# EasyEDA Pro project ProPrj_大功率电调_2026-08-17.epro, board 主控板_1
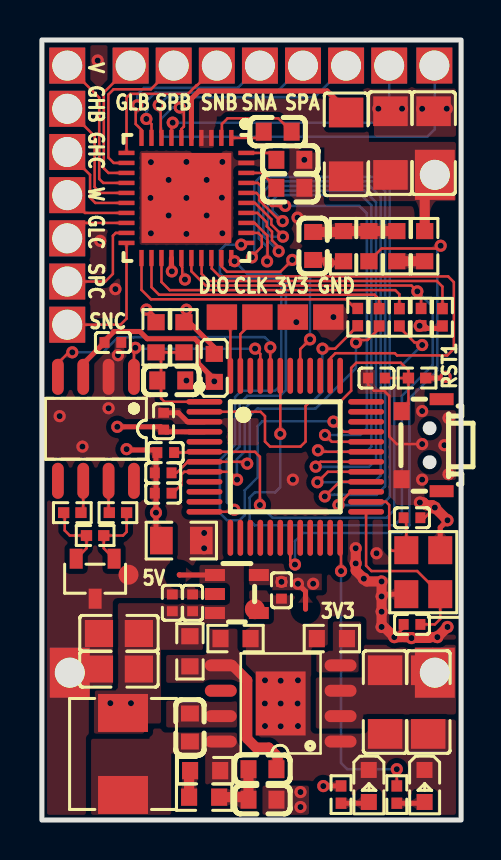
[diagram p23: board, top side]
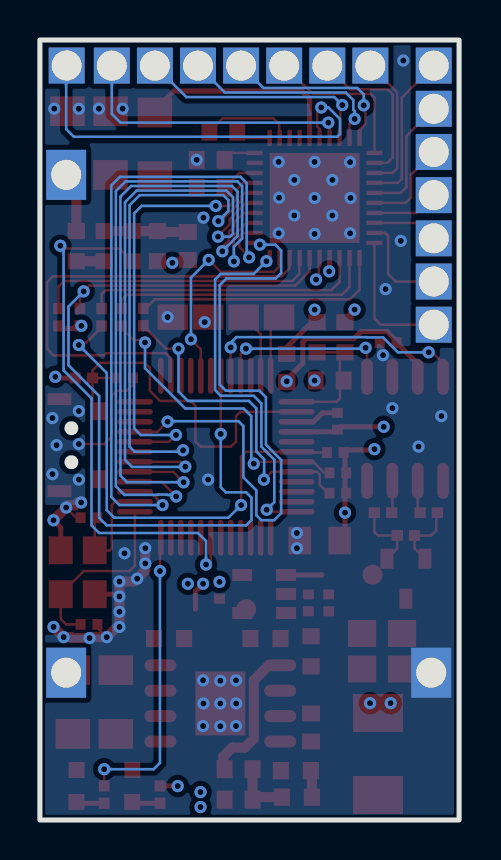
[diagram p24: board, bottom side, seen from below]

Outline 21 x 39 mm; copper layers: Top Layer, Inner1, Inner2, Bottom Layer. Coordinates in mm from the lower left corner of the outline.
Outline path: rectangle 0,39 21,0
Stack: Top Layer 0.035mm Outer layer thickness 1oz / Dielectric1 0.2104mm 7628 RC49% 8.6mil / Inner1 0.0152mm Inner layer thickness / Dielectric2 1.065mm 1.1mm H/HOZ Copper / Inner2 0.0152mm Inner layer thickness / Dielectric3 0.2104mm 7628 RC49% 8.6mil / Bottom Layer 0.035mm Outer layer thickness 1oz

## Design rules (mm)
spacing copperThickness1oz (default): track to track 0.102, other pairs 0.152 to 0.3
spacing copperThickness2oz: track to track 0.203, other pairs 0.152 to 0.3
track width copperThickness1oz (default): min 0.127, default 0.127, max 2.54
track width copperThickness2oz: min 0.203, default 0.254, max 2.54
differential pair differentialPair (default): width min 0.127, default 0.254, max 2.54; gap min 0.152, default 0.152
net VCC_BUS uses copperRegion
net GND uses copperRegion
net $3N8 uses copperRegion
net $3N9 uses copperRegion
net 5V uses copperRegion
net FB uses copperRegion
net 3V3 uses copperRegion
net 3V3_A uses copperRegion
net $1N26 uses copperRegion
net $3N14 uses copperRegion
net VBUS_ADC uses copperRegion

## Placement (name value [footprint] x y rotation side)
C1  47nf  [C0603]  11.81 34.42 180 top
C2  10uF/100v  [C1206]  19.62 33.85 270 top
C3  100nF/100v  [C1206]  17.46 33.85 270 top
C4  1uF  [C1206]  15.24 33.78 90 top
C5  1uf  [C0603]  12.45 33.01 0 top
C6  1uf  [C0603]  12.45 31.61 0 top
C7  1nF  [C0402]  6.08 16.34 0 top
C8  1nF  [C0402]  6.08 17.36 0 top
C9  1nF  [C0402]  6.2 18.37 0 top
C10  2.2nF/50v  [C0603]  7.42 4.63 270 top
C11  22µF/16V  [C0805]  3.86 9.33 0 top
C12  22µF/16V  [C0805]  3.86 7.55 0 top
C13  2.2uf/100v  [C1206]  17.19 5.9 90 top
C14  100nF/100v  [C1206]  19.35 5.9 90 top
C15  3.3nf/50v  [C0603]  11.05 1.02 180 top
C16  150pf/50v  [C0603]  11.05 2.54 180 top
C17  1uF  [C0402]  6.53 10.86 270 top
C18  100nF  [C0402]  7.55 10.86 270 top
C19  1uF  [C0402]  12 11.49 90 top
C20  20pf  [C0402]  18.54 9.78 180 top
C21  100nF  [C0402]  6.1 19.94 270 top
C28  20pf  [C0402]  18.54 15.11 0 top
C29  100nF  [C0402]  16.76 22.1 0 top
C30  100nF  [C0402]  3.56 23.88 0 top
C32  10nF  [C0603]  13.59 28.7 90 top
C33  100nF  [C0603]  6.48 21.98 180 top
D1  PESD2CAN,215  [SOT-23-3_L2.9-W1.3-P1.90-LS2.4-BR]  2.67 12.06 90 top
L1  33uH  [IND-SMD_L5.4-W5.2]  4.06 3.3 270 top
L2  BLM18PG121SN1D  [L0603]  8.64 22.61 90 top
LED1  -  [LED_0603]  16.38 1.65 270 top
LED2  -  [LED_0603]  19.18 1.65 270 top
MARK2  -  [Mark-Point-1mm]  6.88 12.27 0 top
NOREF  -  [Pad_e258]  1.27 35.56 180 top
NOREF#2  -  [Pad_e255]  1.27 29.08 180 top
NOREF#3  -  [Pad_e259]  1.27 37.72 180 top
NOREF#4  -  [Pad_e975]  12.57 25.15 0 top
NOREF#5  -  [Pad_e261]  8.76 37.72 270 top
NOREF#6  -  [Pad_e262]  4.44 37.72 270 top
NOREF#7  -  [Pad_e254]  1.27 26.92 180 top
NOREF#8  -  [Pad_e266]  17.4 37.72 270 top
NOREF#9  -  [Pad_e944]  10.79 25.15 0 top
NOREF#10  -  [Pad_e981]  14.35 25.15 0 top
NOREF#11  -  [Pad_e250]  19.69 7.37 180 top
NOREF#12  -  [Pad_e257]  1.27 33.4 180 top
NOREF#13  -  [Pad_e263]  10.92 37.72 270 top
NOREF#14  -  [Pad_e253]  1.27 24.77 180 top
NOREF#15  -  [Mark-Point-1mm]  13.21 10.54 0 top
NOREF#16  -  [Pad_e264]  13.08 37.72 270 top
NOREF#17  -  [Pad_e921]  9.02 25.15 0 top
NOREF#18  -  [Pad_e260]  6.6 37.72 270 top
NOREF#19  -  [Pad_e267]  19.66 37.72 270 top
NOREF#20  -  [Pad_e706]  19.69 32.26 180 top
NOREF#21  -  [Pad_e256]  1.27 31.24 180 top
NOREF#22  -  [Pad_e247]  1.4 7.37 0 top
NOREF#23  -  [Pad_e265]  15.24 37.72 270 top
R1  10K  [R0402]  18.8 22.1 180 top
R2  5.1  [R0402]  3.81 15.37 0 top
R3  5.1  [R0402]  1.52 15.37 180 top
R4  120  [R0402]  2.67 14.22 0 top
R5  0  [R0805]  6.99 13.97 0 top
R6  10K  [R0402]  14.99 1.27 270 top
R7  10K  [R0402]  17.78 1.27 270 top
R28  10K  [R0402]  20.07 25.14 90 top
R29  10K  [R0402]  19 25.14 90 top
R30  100  [R0402]  17.91 25.14 90 top
R31  100  [R0402]  16.89 25.14 90 top
R32  100  [R0402]  15.82 25.14 90 top
R33  68K  [R0603]  8.18 2.47 180 top
R34  158k  [R0603]  7.42 8.44 90 top
R35  68K  [R0603]  8.13 1.14 180 top
R36  49.9k  [R0603]  9.7 9.07 180 top
R37  31.6k  [R0603]  14.53 9.07 0 top
R43  100  [R0603]  16.38 28.69 270 top
R47  330K  [R0603]  19.18 28.69 270 top
R48  330K  [R0603]  17.78 28.69 90 top
R49  36K  [R0603]  15.11 28.69 270 top
R51  10k  [R0603]  7.12 24.14 270 top
R52  HNTC0603-103F3950FB  [R0603]  5.72 24.14 90 top
RST1  侧按侧贴开关  [KEY-SMD_1TS003B]  19.02 18.74 90 top
U1  DRV8353SRTAR  [WQFN-40_L6.0-W6.0-P0.50-TL-EP4.5]  7.24 31.1 270 top
U2  LKS32MC071CBT8  [TQFP-48_L7.0-W7.0-P0.50-LS9.0-BL]  12.19 18.16 270 top
U3  LM5164DDAR  [SO-8_L4.9-W3.9-P1.27-LS6.0-BL-EP]  11.96 5.83 90 top
U4  SPX3819-3.3  [SOT-23-5_L2.9-W1.6-P0.95-LS2.8-BL]  9.77 11.3 270 top
U7  TCAN332DR  [SOIC-8_L4.9-W3.9-P1.27-LS6.0-BL]  2.71 19.56 180 top
X1  8MHz  [CRYSTAL-SMD_4P-L3.2-W2.5-BL]  19.11 12.39 90 top

## Footprints (pads in the part's own frame, mm; a bottom-side part is the same pattern mirrored in y, then rotated)
C0402
  rect 0.5x0.54 smd: 1(-0.42,0) 2(0.42,0)
C0603
  rect 0.8x0.9 smd: 1(-0.7,0) 2(0.7,0)
C0805
  rect 1.41x1.35 smd: 1(-1,0) 2(1,0)
C1206
  rect 1.485x1.728 smd: 1(-1.593,0) 2(1.593,0)
CRYSTAL-SMD_4P-L3.2-W2.5-BL
  rect 1.4x1.2 smd: 1(-1.1,-0.85) 2(1.1,-0.85) 3(1.1,0.85) 4(-1.1,0.85)
IND-SMD_L5.4-W5.2
  rect 1.9x2.5 smd: 1(2.05,0) 2(-2.05,0)
KEY-SMD_1TS003B
  rect 0.9x0.8 smd: 1(1.7,1) 2(-1.7,1)
  rect 0.6x1.2 smd: 3(-2.3,-1) 4(2.3,-1)
L0603
  rect 0.8x0.864 smd: 1(-0.7,0) 2(0.7,0)
LED_0603
  rect 0.8x0.8 smd: 1(-0.851,-0.01) 2(0.75,-0.005)
Mark-Point-1mm
  round 1 smd: 1(-2.54,0)
Pad_e247
  rect 2x2.5 hole 1.5: 1(0,0)
Pad_e250
  rect 2x2.5 hole 1.5: 1(0,0)
Pad_e253
  rect 1.8x1.8 hole 1.5: 1(0,0)
Pad_e254
  rect 1.8x1.8 hole 1.5: 1(0,0)
Pad_e255
  rect 1.8x1.8 hole 1.5: 1(0,0)
Pad_e256
  rect 1.8x1.8 hole 1.5: 1(0,0)
Pad_e257
  rect 1.8x1.8 hole 1.5: 1(0,0)
Pad_e258
  rect 1.8x1.8 hole 1.5: 1(0,0)
Pad_e259
  rect 1.8x1.8 hole 1.5: 1(0,0)
Pad_e260
  rect 1.8x1.8 hole 1.5: 1(0,0)
Pad_e261
  rect 1.8x1.8 hole 1.5: 1(0,0)
Pad_e262
  rect 1.8x1.8 hole 1.5: 1(0,0)
Pad_e263
  rect 1.8x1.8 hole 1.5: 1(0,0)
Pad_e264
  rect 1.8x1.8 hole 1.5: 1(0,0)
Pad_e265
  rect 1.8x1.8 hole 1.5: 1(0,0)
Pad_e266
  rect 1.8x1.8 hole 1.5: 1(0,0)
Pad_e267
  rect 1.8x1.8 hole 1.5: 1(0,0)
Pad_e706
  rect 2x2.5 hole 1.5: 1(0,0)
Pad_e921
  rect 1.524x1.27 smd: 1(0,0)
Pad_e944
  rect 1.524x1.27 smd: 1(0,0)
Pad_e975
  rect 1.524x1.27 smd: 1(0,0)
Pad_e981
  rect 1.524x1.27 smd: 1(0,0)
R0402
  rect 0.566x0.54 smd: 1(-0.433,0) 2(0.433,0)
R0603
  rect 0.806x0.864 smd: 1(-0.753,0) 2(0.753,0)
R0805
  rect 1.133x1.377 smd: 1(-1,0) 2(1,0)
SO-8_L4.9-W3.9-P1.27-LS6.0-BL-EP
  oval 0.6x1.6 smd: 1(-1.905,-3) 2(-0.635,-3) 3(0.635,-3) 4(1.905,-3) 5(1.905,3) 6(0.635,3) 7(-0.635,3) 8(-1.905,3)
  rect 3.2x2.5 smd: 9(0,0)
SOIC-8_L4.9-W3.9-P1.27-LS6.0-BL
  oval 0.588x1.8 smd: 1(-1.905,-2.6) 2(-0.635,-2.6) 3(0.635,-2.6) 4(1.905,-2.6) 5(1.905,2.6) 6(0.635,2.6) 7(-0.635,2.6) 8(-1.905,2.6)
SOT-23-3_L2.9-W1.3-P1.90-LS2.4-BR
  rect 1x0.65 smd: 1(1,-0.95) 2(1,0.95) 3(-1,0)
SOT-23-5_L2.9-W1.6-P0.95-LS2.8-BL
  rect 0.6x1 smd: 1(-0.95,-1.1) 2(0,-1.1) 3(0.95,-1.1) 4(0.95,1.1) 5(-0.95,1.1)
TQFP-48_L7.0-W7.0-P0.50-LS9.0-BL
  oval 0.28x1.8 smd: 1(-2.75,-4.05) 2(-2.25,-4.05) 3(-1.75,-4.05) 4(-1.25,-4.05) 5(-0.75,-4.05) 6(-0.25,-4.05) 7(0.25,-4.05) 8(0.75,-4.05) 9(1.25,-4.05) 10(1.75,-4.05) 11(2.25,-4.05) 12(2.75,-4.05) 25(2.75,4.05) 26(2.25,4.05) 27(1.75,4.05) 28(1.25,4.05) 29(0.75,4.05) 30(0.25,4.05) 31(-0.25,4.05) 32(-0.75,4.05) 33(-1.25,4.05) 34(-1.75,4.05) 35(-2.25,4.05) 36(-2.75,4.05)
  oval 1.8x0.28 smd: 13(4.05,-2.75) 14(4.05,-2.25) 15(4.05,-1.75) 16(4.05,-1.25) 17(4.05,-0.75) 18(4.05,-0.25) 19(4.05,0.25) 20(4.05,0.75) 21(4.05,1.25) 22(4.05,1.75) 23(4.05,2.25) 24(4.05,2.75) 37(-4.05,2.75) 38(-4.05,2.25) 39(-4.05,1.75) 40(-4.05,1.25) 41(-4.05,0.75) 42(-4.05,0.25) 43(-4.05,-0.25) 44(-4.05,-0.75) 45(-4.05,-1.25) 46(-4.05,-1.75) 47(-4.05,-2.25) 48(-4.05,-2.75)
WQFN-40_L6.0-W6.0-P0.50-TL-EP4.5
  rect 0.8x0.22 smd: 1(-3,2.25) 2(-3,1.75) 3(-3,1.25) 4(-3,0.75) 5(-3,0.25) 6(-3,-0.25) 7(-3,-0.75) 8(-3,-1.25) 9(-3,-1.75) 10(-3,-2.25) 21(3,-2.25) 22(3,-1.75) 23(3,-1.25) 24(3,-0.75) 25(3,-0.25) 26(3,0.25) 27(3,0.75) 28(3,1.25) 29(3,1.75) 30(3,2.25)
  rect 0.22x0.8 smd: 11(-2.25,-3) 12(-1.75,-3) 13(-1.25,-3) 14(-0.75,-3) 15(-0.25,-3) 16(0.25,-3) 17(0.75,-3) 18(1.25,-3) 19(1.75,-3) 20(2.25,-3) 31(2.25,3) 32(1.75,3) 33(1.25,3) 34(0.75,3) 35(0.25,3) 36(-0.25,3) 37(-0.75,3) 38(-1.25,3) 39(-1.75,3) 40(-2.25,3)
  rect 4.5x4.5 smd: 41(0,0)

## Nets
3V3: C19.2 C30.1 L2.1 NOREF#4.1 NOREF#15.1 R1.1 R6.1 R28.1 R29.1 U4.5 U7.3
3V3_A: C21.2 L2.2 R51.1 U1.24 U2.4
5V: C11.2 C12.2 C15.1 C17.2 C18.2 L1.2 MARK2.1 R34.2 U4.1 U4.3
AGND: C7.1 C8.1 C9.1 C32.1 C33.1 R5.1 R49.2 R52.2 U1.25
GND: C2.1 C3.1 C5.2 C6.2 C11.1 C12.1 C13.1 C14.1 C17.1 C18.1 C19.1 C20.2 C21.1 C28.2 C29.1 C30.2 D1.3 LED1.1 LED2.1 NOREF#10.1 NOREF#22.1 R5.2 R36.1 R37.1 RST1.2 U1.39 U1.41 U2.3 U3.1 U3.9 U4.2 U7.2 X1.2 X1.4
PVCC_BUS: C2.2 C3.2 C4.1 NOREF#20.1 R47.1 U1.3 U1.4
VBUS_ADC: R43.2 U2.19
VCC_BUS: C13.2 C14.2 NOREF#11.1 U3.2 U3.3
CANH: D1.1 R2.2 R4.2
CANL: D1.2 R3.2 R4.1
ENABLE: U1.31 U2.33
FB: C16.1 R34.1 R36.2 U3.5
GHA: NOREF#19.1 U1.6
GHB: NOREF.1 U1.15
GHC: NOREF#12.1 U1.16
GLA: NOREF#23.1 U1.8
GLB: NOREF#6.1 U1.13
GLC: NOREF#2.1 U1.18
INHA: U1.32 U2.27
INHB: U1.34 U2.29
INHC: U1.36 U2.31
INLA: U1.33 U2.28
INLB: U1.35 U2.30
INLC: U1.37 U2.32
LED: R7.1 U2.24
nFAULT: R29.2 U1.26 U2.43
NRST: C29.2 R1.2 RST1.1 U2.2
nSCS: U1.30 U2.12
NTC_ADC: C33.2 R51.2 R52.1 U2.1
OSC_IN: C20.1 U2.25 X1.1
OSC_OUT: C28.1 U2.26 X1.3
RAMP_NODE: C15.2 C16.2 R35.1
RXD: U2.44 U7.4
SCLK: U1.29 U2.41
SD0: U2.37
SDI: U1.28 U2.38
SDO: R28.2 U1.27
SNA: NOREF#13.1 U1.10
SNB: NOREF#5.1 U1.11
SNC: NOREF#14.1 U1.20
SOA: C9.2 R30.1 U2.6
SOB: C8.2 R31.1 U2.7
SOC: C7.2 R32.1 U2.8
SPA: NOREF#16.1 U1.9
SPB: NOREF#18.1 U1.12
SPC: NOREF#7.1 U1.19
SWCLK: NOREF#9.1 U2.47
SWDIO: NOREF#17.1 U2.48
TXD: U2.45 U7.1
U: NOREF#8.1 U1.7
V: NOREF#3.1 U1.14
W: NOREF#21.1 U1.17
$1N4: LED2.2 R7.2
$1N5: LED1.2 R6.2
$1N19: R2.1 U7.7
$1N20: R3.1 U7.6
$1N26: C32.2 R43.1 R48.2 R49.1
$1N27: R47.2 R48.1
$2N6: C6.1 U1.38
$2N8: C5.1 U1.40
$2N26: R32.2 U1.21
$2N27: R31.2 U1.22
$2N28: R30.2 U1.23
$2N30: C4.2 U1.5
$2N42: C1.1 U1.2
$2N43: C1.2 U1.1
$3N3: R33.2 R35.2
$3N8: C10.2 L1.1 R33.1 U3.8
$3N9: C10.1 U3.7
$3N14: R37.2 U3.4

Pads without a net: RST1 3 4; U2 5 9 10 11 13 14 15 16 17 18 20 21 22 23 34 35 36 39 40 42 46; U3 6; U4 4; U7 5 8

## Via types
v1: diameter 0.61, hole 0.305, Top Layer to Bottom Layer, 120 vias

## Routing (per net, layer and track width the routed paths; a pad name or vN(x,y) marks a point on that pad's centre or on a via; arc(x,y) is an arc through that point)
3V3: length 58
  Top Layer w0.127: 19.3,24.58 19.06,24.58 v1(18.92,24.71)
  Top Layer w0.254: R6.1 14.1,1.7 v1(14.1,1.7) ; 20.07,24.58 19.3,24.58 19.17,24.71 v1(18.92,24.71) ; v1(12.83,11.81) 13.21,11.43 13.21,10.54 ; v1(20.23,22.16) 20.17,22.1 R1.1 ; 8.64,22.03 7.83,22.84 7.83,23.9 7.66,24.06 5.27,24.06 4.91,24.42 3.61,24.42 3.14,23.95 C30.1 2.07,22.81 2.07,22.16
  Inner2 w0.254: 17.4,22.16 17.4,24.13 17.98,24.71 v1(18.92,24.71) ; 17.4,22.16 v1(20.23,22.16) ; 17.4,22.16 12.78,22.16 ; v1(14.1,1.7) 13.59,2.2 v1(13.59,11.81) v1(12.83,11.81) 9.4,11.81 9.06,12.15 9.06,19.22 9.78,19.94 9.78,22.16 8.86,22.16 v1(8.64,21.93) ; 12.78,22.16 12.78,24.85 v1(12.74,24.89) ; 12.78,22.16 9.78,22.16
  vias: v1(12,11.91)
3V3_A: length 21.8
  Top Layer w0.127: v1(7.24,25.51) 7.37,25.38 7.37,24.89
  Top Layer w0.254: 8.64,23.43 8.64,23.63 7.37,24.89 7.12,24.89 R51.1 ; U2.4 6.2,19.41 5.96,19.66 v1(3.78,19.66) ; v1(6.51,27.43) 6.49,27.45 U1.24
  Inner2 w0.254: v1(3.78,19.66) 4.06,19.95 4.06,21.46 3.05,22.48 3.05,27.05 3.43,27.43 v1(6.51,27.43) 6.51,26.26 7.24,25.53
5V: length 1.8
  Top Layer w0.254: 6.88,12.27 6.9,12.25 8.67,12.25
  vias: v1(3.43,5.84) v1(4.46,5.84) v1(12.95,1.4) v1(12.95,0.65)
AGND: length 9.8
  Top Layer w0.127: v1(7.17,27.02) 7.03,27.16 7.03,27.65 6.99,27.69 U1.25 ; 5.97,24.89 5.34,25.52 v1(5.24,25.52)
  Top Layer w0.254: C32.1 14.22,28 v1(14.37,27.86) 15.03,27.86 R49.2 ; R5.1 5.72,14.24 v1(5.72,15.37) 5.72,18.37 ; 4.23,18.5 5.6,18.5 5.73,18.37
  vias: v1(4.24,18.54) v1(7.24,21.97)
GND: length 22.7
  Top Layer w0.127: v1(19.69,15.62) 19.18,15.11 C28.2 ; v1(19.05,18.8) 17.78,18.8 17.4,19.18 17.4,21.21 17.15,21.46 16.64,21.46 16.34,21.76 C29.1 ; C20.2 18.12,9.61 v1(17.65,9.14)
  Top Layer w0.254: C21.1 6.84,20.36 7.29,19.91 U2.3 ; X1.4 17.13,11.29 v1(17.02,11.18) ; v1(20.32,14.99) 19.96,14.62 X1.2
  Top Layer w0.508: v1(18.94,15.88) 19.12,15.88 19.26,15.73 19.57,15.73 v1(19.69,15.62) v1(20.32,14.99) ; v1(20.32,9.65) v1(19.81,9.14) 19.42,9.14 19.38,9.1 18.54,9.1 18.5,9.14 v1(17.65,9.14) 17.02,9.78 v1(17.02,10.41) v1(17.02,11.18) v1(17.02,11.93) 16.27,11.93 v1(16.13,12.06) 15.72,12.47 v1(15.72,12.83) v1(15.72,13.59)
  vias: v1(0.89,20.19) v1(2.03,18.67) v1(2.79,37.97) v1(2.92,28.96) v1(3.34,20.59) v1(3.68,26.54) v1(3.81,23.24) v1(5.44,31.1) v1(5.46,32.89) v1(5.46,29.34) v1(6.35,32) v1(6.35,30.23) v1(7.24,32.9) v1(7.24,31.1) v1(7.24,29.3) v1(8.13,14.35) v1(8.13,13.59) v1(8.25,32) v1(8.25,30.23) v1(9.04,32.9) v1(9.02,31.11) v1(9.04,29.34) v1(11.18,6.98) v1(11.17,5.83) v1(11.18,4.7) v1(11.96,6.96) v1(11.96,5.83) v1(11.96,4.69) v1(12.57,17.02) v1(12.81,30.12) v1(12.83,6.98) v1(12.81,5.83) v1(12.83,4.7) v1(13.15,33.01) v1(14.6,25.15) v1(16.76,13.33) v1(16.86,35.56) v1(17.02,9.65) v1(18.04,35.56) v1(18.52,9.1) v1(19.05,35.56) v1(19.05,20.45) v1(19.05,17.02) v1(20.16,18.74) v1(20.28,35.56) v1(20.37,20.1) v1(20.37,17.29)
PVCC_BUS: length 3.1
  Top Layer w0.508: 19.18,29.44 19.18,31.94 19.62,32.38
VBUS_ADC: length 27.2
  Top Layer w0.127: v1(19.98,28.71) 19.84,28.58 17.02,28.58 R43.2 ; U2.19 12.44,12.96 12.63,12.77 v1(12.68,12.77)
  Bottom Layer w0.127: v1(19.98,28.71) 19.81,28.55 19.81,22.48 18.41,21.08 18.41,14.73 18.03,14.35 13.08,14.35 12.68,13.95 v1(12.68,12.77)
CANH: length 3.6
  Top Layer w0.127: R2.2 4.24,14.4 4.06,14.22 R4.2 3.1,13.58 D1.1
CANL: length 3.5
  Top Layer w0.127: D1.2 2.23,13.58 R4.1 1.4,14.22 1.14,14.48 1.14,15.31 R3.2
ENABLE: length 31.3
  Top Layer w0.127: v1(14.6,19.92) 15.11,19.41 U2.33
  Bottom Layer w0.127: v1(9.98,28.77) 9.21,28.77 8.91,28.47 8.91,27.35 9.19,27.08 11.66,27.08 12,26.74 12,21.77 11.68,21.46 10,21.46 9.68,21.14 9.68,18.76 8.91,18 8.91,15.34 9.27,14.99 9.91,14.99 10.16,15.24 10.16,16.48 10.81,17.13 10.81,19.7 11.05,19.94 14.59,19.94 v1(14.6,19.92)
FB: length 7.1
  Top Layer w0.508: U3.5 9.54,7.73 10.29,6.98 10.29,4.06 10.73,3.62 11.37,3.62 11.81,3.17 11.81,2.6 C16.1
GHA: length 20.7
  Top Layer w0.127: v1(6.91,35.62) 7.11,35.42 7.11,34.67 6.99,34.55 U1.6
  Bottom Layer w0.127: v1(6.91,35.62) 6.54,35.62 5.97,35.05 5.97,34.29 6.1,34.16 19.3,34.16 19.69,34.54 19.69,37.7 NOREF#19.1
GHB: length 6.2
  Top Layer w0.127: U1.15 2.94,31.35 2.64,31.65 2.64,34.19 NOREF.1
GHC: length 4.7
  Top Layer w0.127: NOREF#12.1 2.41,32.26 2.41,31.11 2.67,30.85 U1.16
GLA: length 11.9
  Top Layer w0.127: U1.8 6.01,34.13 6.01,34.33 5.95,34.39 5.95,35.65 v1(5.85,35.75)
  Bottom Layer w0.127: NOREF#23.1 13.67,36.15 6.25,36.15 v1(5.85,35.75)
GLB: length 6.9
  Top Layer w0.127: U1.13 3.33,32.35 3.1,32.59 3.1,36.37 NOREF#6.1
GLC: length 3.3
  Top Layer w0.127: NOREF#2.1 2.04,29.85 U1.18
INHA: length 32.9
  Top Layer w0.127: v1(14.86,15.75) 15.13,16.02 15.13,16.06 15.48,16.41 U2.27 ; v1(10.52,28.13) 10.52,28.17 11.01,28.67 11.01,29.17 10.84,29.35 U1.32
  Bottom Layer w0.127: v1(14.86,15.75) 17.02,15.75 17.42,16.15 17.42,31.72 16.99,32.16 10.95,32.16 10.64,31.85 10.64,28.34 10.52,28.22 v1(10.52,28.13)
INHB: length 32.3
  Top Layer w0.127: U2.29 14.33,17.41 v1(13.8,16.89) ; U1.34 10.79,30.35 11.27,29.88 11.27,29.68 11.53,29.42 11.53,28.98 11.86,28.65 v1(11.86,28.44)
  Bottom Layer w0.127: v1(13.8,16.89) 13.81,16.89 16.64,16.89 16.97,17.22 16.97,31.17 16.43,31.7 11.38,31.7 11.1,31.42 11.1,29.2 v1(11.86,28.44)
INHC: length 26.4
  Top Layer w0.127: v1(12.06,29.94) 11.94,29.94 10.9,30.98 10.9,31.19 10.74,31.35 U1.36 ; U2.31 13.9,18.41 v1(13.83,18.48)
  Bottom Layer w0.127: v1(13.83,18.48) 13.9,18.42 16.26,18.42 16.51,18.67 16.51,30.74 16,31.24 11.81,31.24 11.56,30.99 11.56,30.45 v1(12.06,29.94)
INLA: length 33.6
  Top Layer w0.127: U1.33 10.66,29.85 11.3,29.22 11.3,28.89 11.3,28.88 11.3,27.95 v1(11.28,27.93) ; v1(14.17,16.18) 14.91,16.91 U2.28
  Bottom Layer w0.127: v1(11.28,27.93) 11.28,28.66 10.87,29.07 10.87,31.7 11.1,31.93 16.71,31.93 17.19,31.45 17.19,16.69 16.76,16.26 15.09,16.26 15.07,16.27 14.64,16.27 14.63,16.26 14.25,16.26 v1(14.17,16.18)
INLB: length 29.8
  Top Layer w0.127: v1(13.72,17.67) 13.96,17.91 U2.30 ; U1.35 10.68,30.85 11.5,30.03 11.5,29.78 12.08,29.19 v1(12.08,29.17)
  Bottom Layer w0.127: v1(13.72,17.67) 13.73,17.65 16.38,17.65 16.74,18.01 16.74,30.89 16.15,31.47 11.66,31.47 11.33,31.14 11.33,29.31 11.47,29.17 v1(12.08,29.17)
INLC: length 22.1
  Top Layer w0.127: U2.32 14.52,18.91 v1(14.18,19.25) ; v1(12.19,30.7) 11.5,30.7 11.13,31.07 11.13,31.54 10.82,31.85 U1.37
  Bottom Layer w0.127: v1(14.18,19.25) 15.95,19.25 16.28,19.58 16.28,30.33 15.9,30.7 v1(12.19,30.7)
LED: length 15
  Top Layer w0.127: U2.24 14.99,14.07 v1(14.99,12.45) ; v1(17.78,2.54) R7.1
  Bottom Layer w0.127: v1(17.78,2.54) 15.3,2.54 14.99,2.85 v1(14.99,12.45)
NFAULT: length 31.2
  Top Layer w0.127: 19,25.45 19,26.24 18.81,26.43 ; 18.52,26.72 8.2,26.72
  Bottom Layer w0.127: 10.67,14.73 17.65,14.73 18.03,15.11 18.03,21.2 19.57,22.74 19.57,25.67 18.81,26.43
nFAULT: length 10.9
  Top Layer w0.127: U2.43 v1(11.94,19.3) ; 8.2,26.72 7.49,27.44 U1.26 ; 18.52,26.72 v1(18.81,26.43)
  Bottom Layer w0.127: 10.67,14.73 10.4,15 10.4,16.12 10.67,16.38 11.68,16.38 11.94,16.64 v1(11.94,19.3)
NRST: length 18.4
  Top Layer w0.127: R1.2 18.36,20.78 RST1.1 ; R1.2 18.36,22.48 17.98,22.86 15.75,22.86 15.49,22.61 15.49,21.46 14.99,20.95 13.46,20.95 13.21,20.7 13.21,18.92 12.95,18.67 11.43,18.67 11.18,18.92 11.18,20.19 10.96,20.41 U2.2 ; R1.2 17.44,22.1
NSCS: length 16.8
  Bottom Layer w0.127: v1(9.65,27.94) 10.29,27.31 11.94,27.31 12.22,27.02 12.22,21.5 11.94,21.21 10.29,21.21 9.91,20.83 9.91,18.67 9.26,18.02 9.26,15.89 9.64,15.51
nSCS: length 1.5
  Top Layer w0.127: v1(9.64,15.51) 9.54,15.41 U2.12
NTC_ADC: length 5.9
  Top Layer w0.127: 5.85,23.38 5.97,23.38 ; 5.97,23.38 7.24,23.38 ; 5.97,23.38 5.97,23.38 5.97,21.08 6.14,20.91 U2.1
OSC_IN: length 9.3
  Top Layer w0.127: U2.25 16.24,12.71 16.51,12.45 18.8,12.45 X1.1 19.96,10.05 19.69,9.78 C20.1
OSC_OUT: length 6
  Top Layer w0.127: U2.26 17.24,15.91 17.4,15.75 17.4,13.59 17.53,13.46 18.23,13.46 X1.3 18.26,14.98 C28.1
RAMP_NODE: length 3
  Top Layer w0.508: R35.1 10.22,1.14 10.35,1.02 10.35,2.54
RXD: length 13.6
  Top Layer w0.127: 0.8,22.16 0.8,22.84 1.34,23.38 v1(1.52,23.38) ; U2.44 v1(11.44,23.63)
  Bottom Layer w0.127: v1(1.52,23.38) 3.06,23.38 3.81,24.13 4.6,24.13 4.61,24.14 11.16,24.14 11.44,23.86 v1(11.44,23.63)
SCLK: length 10.7
  Top Layer w0.127: v1(13.43,24.03) 12.94,23.54 U2.41 ; U1.29 8.99,27.69 9.27,27.41 11.95,27.41 v1(12.54,28)
  Bottom Layer w0.127: v1(12.54,28) 13.43,27.11 v1(13.43,24.03)
SDI: length 23.6
  Top Layer w0.127: U2.38 14.48,22.25 14.48,23.11 14.7,23.34 17.68,23.34 17.79,23.23 20.31,23.23 20.64,23.56 20.64,26.89 20.35,27.18 8.9,27.18 8.51,27.57 8.51,28.08 U1.28
SDO: length 14.4
  Top Layer w0.127: 20.07,25.44 20.07,26.67 19.78,26.95 8.35,26.95 8,27.31 8,28.09 U1.27
SNA: length 9.1
  Top Layer w0.127: U1.10 4.99,34.51 4.7,34.8 4.7,35.65 v1(4.78,35.73)
  Bottom Layer w0.127: NOREF#13.1 9.81,36.6 5.11,36.6 4.78,36.27 v1(4.78,35.73)
SNB: length 7.9
  Top Layer w0.127: U1.11 4.24,36.12 4.43,36.31 7.32,36.31 7.75,36.74 7.79,36.74 NOREF#5.1
SNC: length 6.9
  Top Layer w0.127: U1.20 4.24,25.07 3.94,24.77 NOREF#14.1
SOA: length 24.2
  Top Layer w0.127: 17.91,24.58 17.97,24.58 18.67,23.88 18.92,23.88 v1(19.05,23.75) ; 6.75,18.37 8.1,18.37 U2.6 10.67,18.41 10.92,18.16 v1(10.92,15.75)
  Bottom Layer w0.127: v1(10.92,15.75) 11.56,15.11 17.27,15.11 17.65,15.49 17.65,22.35 v1(19.05,23.75)
SOB: length 15.3
  Top Layer w0.127: 6.75,17.36 7.31,17.91 U2.7 10.19,17.91 v1(10.29,17.82) ; v1(15.74,23.88) 15.86,24 16.32,24 16.89,24.58
  Bottom Layer w0.127: v1(15.74,23.88) 15.74,22.59 13.72,20.57 10.79,20.57 10.41,20.19 10.41,17.94 v1(10.29,17.82)
SOC: length 16.6
  Top Layer w0.127: R32.1 15.52,24.41 15.52,24.4 14.69,23.57 v1(14.06,23.57) ; v1(9.78,17.02) 9.39,17.41 U2.8 7.13,17.41 6.99,17.27 6.99,16.76 6.56,16.34 C7.2
  Bottom Layer w0.127: v1(14.06,23.57) 14.06,21.42 13.59,20.95 10.53,20.95 10.16,20.58 10.16,18.43 9.77,18.03 9.77,17.03 v1(9.78,17.02)
SPA: length 10.5
  Top Layer w0.127: v1(5.23,35.05) 5.49,34.79 U1.9
  Bottom Layer w0.127: v1(5.23,35.05) 5.23,35.45 5.3,35.52 5.3,35.99 5.68,36.37 11.74,36.37 NOREF#16.1
SPB: length 8.1
  Top Layer w0.127: NOREF#18.1 6.6,37.68 5.46,36.54 3.59,36.54 3.33,36.27 3.33,33.12 3.59,32.85 U1.12
SPC: length 5.1
  Top Layer w0.127: NOREF#7.1 3.18,26.92 3.56,27.31 3.56,29.21 3.7,29.35 U1.19
SWCLK: length 3.3
  Top Layer w0.127: NOREF#9.1 9.94,24.29 U2.47
SWDIO: length 3.1
  Top Layer w0.127: NOREF#17.1 9.44,24.72 U2.48
TXD: length 9
  Top Layer w0.127: v1(4.68,23.61) 4.61,23.54 4.61,22.16 ; U2.45 10.94,23.31 v1(10.68,23.57)
  Bottom Layer w0.127: v1(4.68,23.61) 4.72,23.57 v1(10.68,23.57)
U: length 14.2
  Top Layer w0.127: v1(6.55,34.87) 6.49,34.8 U1.7
  Bottom Layer w0.127: v1(6.55,34.87) 16.96,34.87 17.4,35.31 NOREF#8.1
V: length 7.8
  Top Layer w0.127: U1.14 3.07,31.85 2.87,32.05 2.87,36.12 NOREF#3.1
W: length 3.3
  Top Layer w0.127: NOREF#21.1 2.16,30.35 U1.17
$1N4: length 1.4
  Top Layer w0.254: LED2.2 19.11,0.84 R7.2
$1N5: length 1.4
  Top Layer w0.254: LED1.2 16.31,0.84 R6.2
$1N19: length 1.6
  Top Layer w0.127: U7.7 3.34,15.4 R2.1
$1N20: length 1.6
  Top Layer w0.127: U7.6 2.07,15.48 R3.1
$1N26: length 4.2
  Top Layer w0.508: 17.78,29.44 15.11,29.44 15.07,29.4 C32.2
$1N27: length 1.4
  Top Layer w0.508: R48.1 R47.2
$2N6: length 1.8
  Top Layer w0.127: C6.1 11,32.35 U1.38
$2N8: length 1.6
  Top Layer w0.127: C5.1 11.4,33.35 U1.40
$2N26: length 12.9
  Top Layer w0.127: U1.21 4.99,26.51 5.46,26.03 15.24,26.03 15.82,25.45
$2N27: length 13.7
  Top Layer w0.127: U1.22 5.49,26.64 5.87,26.26 16.66,26.26 16.89,26.03 16.89,25.44
$2N28: length 14.2
  Top Layer w0.127: 17.91,25.44 17.91,26.29 17.7,26.49 6.4,26.49 5.99,26.9 U1.23
$2N30: length 10.3
  Top Layer w0.254: U1.5 7.49,36.06 7.87,36.45 14.29,36.45 15.24,35.5
$2N42: length 4.6
  Top Layer w0.127: C1.1 11.85,35.08 9.3,35.08 9.02,34.8 9.02,34.13 U1.2
$2N43: length 1.7
  Top Layer w0.127: U1.1 11.18,34.1
$3N3: length 1.3
  Top Layer w0.508: R33.2 7.37,2.42 R35.2

## Copper pours and planes (outline as drawn; the poured copper is in the pictures)
3V3 on Top Layer: 11.55,12.32 14.02,12.32 14.02,11.49 11.55,11.49
3V3 on Top Layer: 10.17,12.82 12.54,12.82 12.54,11.74 10.17,11.74
5V on Top Layer: 7.9,11.73 7.89,11.73 7.89,12.76 10.12,12.76 10.12,10.77 9.29,10.77 9.29,11.73
5V on Top Layer: 5.97,4.06 2.61,4.06 2.61,6.48 3.68,6.48 3.81,6.6 3.81,10.84 10.25,10.84 10.25,9.82 8.07,9.82 8.07,8.51 5.97,8.51
5V on Top Layer: 11.05,1.72 13.38,1.72 13.38,0 11.05,0
5V on Inner2: 2.78,5.24 2.78,5.25 2.78,6.35 5.33,6.35 5.33,1.72 13.41,1.72 13.41,0 2.79,0 2.78,0.01
AGND on Inner2: 3.3,28.07 9.65,28.07 9.65,13.08 3.3,13.08
AGND on Inner2: 8,28.19 15.29,28.19 15.29,25.91 8,25.91
GND on Top Layer: -1.14,40.39 22.22,40.39 22.22,-1.65 -1.14,-1.65
GND on Bottom Layer: -1.14,40.39 22.22,40.39 22.22,-1.65 -1.14,-1.65
GND on Inner1: -1.14,40.39 23.11,40.39 23.11,-1.4 -1.14,-1.4
GND on Inner2: -3.43,41.53 23.5,41.53 23.5,-2.29 -3.43,-2.29
PVCC_BUS on Top Layer: 8.76,33.4 7.75,33.4 7.75,35.94 8,36.19 14.1,36.19 14.1,34.67 16.38,34.67 16.38,31.43 14.15,31.43 14.15,33.63 13.13,33.63 13.13,35.18 8.76,35.18
PVCC_BUS on Top Layer: 14.38,33.91 21,33.91 21,30.94 14.38,30.94
VCC_BUS on Top Layer: 13.72,4.57 13.72,7.11 13.73,7.13 16.13,7.13 16.13,8.76 20.98,8.76 21,8.74 21,5.28 16.1,5.28 16.1,4.57
FB on Top Layer: 6.1,6.86 6.1,8.38 6.12,8.41 8.32,8.41 8.32,9.73 9.96,9.73 9.96,9.73 9.96,6.86
$3N8 on Top Layer: 9.99,4.63 9.99,3.33 9.75,3.33 9.75,1.88 9.65,1.78 8.18,1.78 8.18,3.33 6.5,3.33 6.48,3.3 6.48,-0.04 2.46,-0.04 2.46,4.06 5.38,4.06 5.38,4.57 9.93,4.57
$3N9 on Top Layer: 6.22,5.97 9.91,5.97 9.91,4.63 6.22,4.63
$3N14 on Top Layer: 16,7.24 13.75,7.24 13.75,8.46 14.58,8.46 14.58,9.93 16,9.93

Small or netless copper shapes (teardrops, artwork), in the pictures only: 244 on Top Layer, 44 on Bottom Layer, 18 on Inner2

## Text on the board
Top Silkscreen Layer: SNC | GLB | 5V | SPB | DIO | SNB | CLK | SNA | 3V3 | SPA | GND | GHB | GHC | W | GLC | SPC | V
